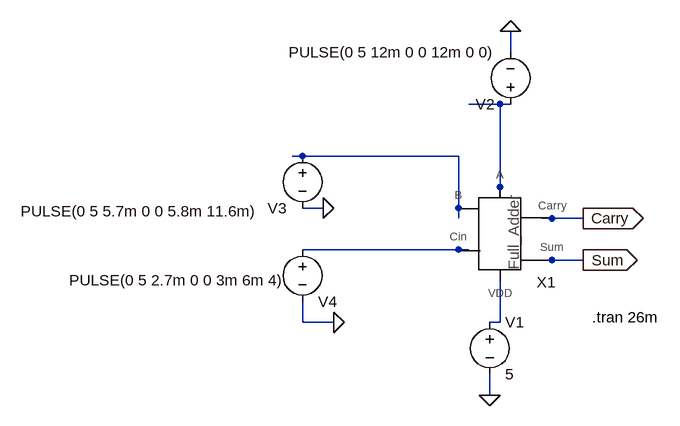
[diagram p0: schematic Simulating_Full_Adder.asc]
Simulating_Full_Adder.asc, the LTspice schematic file:
Version 4
SHEET 1 880 680
WIRE 80 -128 80 -160
WIRE 64 -48 16 -48
WIRE 80 -48 64 -48
WIRE -240 32 -256 32
WIRE 0 32 -240 32
WIRE 64 80 64 -48
WIRE 64 96 64 80
WIRE -208 112 -240 112
WIRE 0 112 0 32
WIRE 0 128 0 112
WIRE 144 128 128 128
WIRE 192 128 144 128
WIRE 0 176 -240 176
WIRE 16 176 0 176
WIRE 144 192 128 192
WIRE 192 192 144 192
WIRE -240 288 -240 256
WIRE -192 288 -240 288
WIRE 64 288 64 224
WIRE 64 288 48 288
WIRE 48 400 48 368
FLAG 80 -160 0
FLAG 48 400 0
FLAG -192 288 0
FLAG -208 112 0
FLAG 192 192 Sum
IOPIN 192 192 Out
FLAG 192 128 Carry
IOPIN 192 128 Out
SYMBOL voltage 48 272 R0
WINDOW 123 0 0 Left 2
WINDOW 39 0 0 Left 2
SYMATTR InstName V1
SYMATTR Value 5
SYMBOL voltage 80 -32 R180
WINDOW 123 0 0 Left 2
WINDOW 39 0 0 Left 2
SYMATTR InstName V2
SYMATTR Value PULSE(0 5 12m 0 0 12m 0 0)
SYMBOL voltage -240 16 M0
WINDOW 0 24 96 Left 2
WINDOW 3 69 101 Left 2
WINDOW 123 0 0 Left 2
WINDOW 39 0 0 Left 2
SYMATTR InstName V3
SYMATTR Value PULSE(0 5 5.7m 0 0 5.8m 11.6m)
SYMBOL voltage -240 160 R0
WINDOW 0 24 96 Left 2
WINDOW 3 -359 63 Left 2
WINDOW 123 0 0 Left 2
WINDOW 39 0 0 Left 2
SYMATTR InstName V4
SYMATTR Value PULSE(0 5 2.7m 0 0 3m 6m 4)
SYMBOL Full_Adder 96 208 R0
SYMATTR InstName X1
TEXT 206 280 Left 2 !.tran 26m

The netlist it stands for:
* Simulating_Full_Adder.asc
V1 N004 0 5
V2 N001 0 PULSE(0 5 12m 0 0 12m 0 0)
V3 N002 0 PULSE(0 5 5.7m 0 0 5.8m 11.6m)
V4 N003 0 PULSE(0 5 2.7m 0 0 3m 6m 4)
XX1 N001 N002 N003 N004 Sum Carry Full_Adder  ; pins A B Cin VDD Sum Carry
.tran 26m
.backanno
.end

* Results of the author's LTspice run, read from the files saved beside the schematic
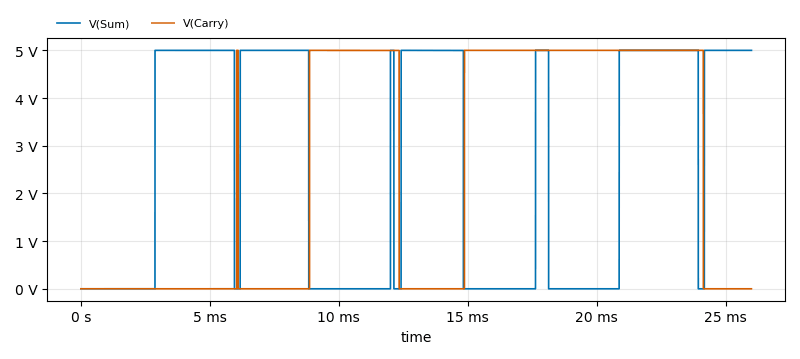
[diagram p1: Transient Analysis of Simulating_Full_Adder.asc, plotted from the saved traces]
* Transient Analysis, 1 run:
*   V(Sum): min 0 V, max 5 V, average 2.632 V, rms 3.628 V, last 5 V
*   V(Carry): min 0 V, max 5 V, average 2.461 V, rms 3.508 V, last 0 V